# EAGLE design nrf24 (EAGLE 6.5.0)
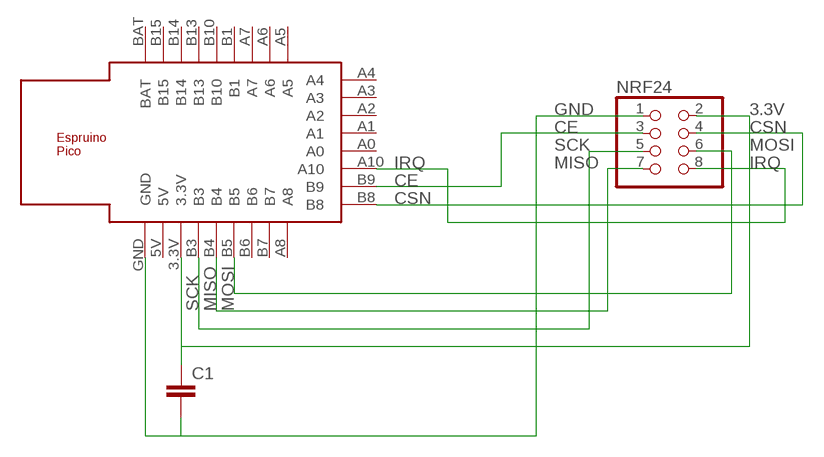
[diagram p0: schematic, sheet 1]

## Parts
C1  C-EUC1206  [C1206]
NRF24  PINHD-2X4  [2X04]
U$2  ESPRUINO_PICO_HALFSMD  [ESPRUINO_PICO_HALFSMD]

## Nets
3.3V: C1.1 NRF24.2 U$2.3.3V
CE: NRF24.3 U$2.B9
CSN: NRF24.4 U$2.B8
GND: C1.2 NRF24.1 U$2.GND
IRQ: NRF24.8 U$2.A10
MISO: NRF24.7 U$2.B4
MOSI: NRF24.6 U$2.B5
SCK: NRF24.5 U$2.B3
Unconnected: U$2.5V U$2.A0 U$2.A1 U$2.A2 U$2.A3 U$2.A4 U$2.A5 U$2.A6 U$2.A7 U$2.A8 U$2.B1 U$2.B6 U$2.B7 U$2.B10 U$2.B13 U$2.B14 U$2.B15 U$2.BAT

## Library data of the parts
C1 = rcl:C-EU: CAPACITOR, European symbol
NRF24 = pinhead:PINHD-2X4: PIN HEADER
U$2 = espruino_pico:ESPRUINO_PICO_HALFSMD

## Net classes
0 default: width 0.305 mm

## Board
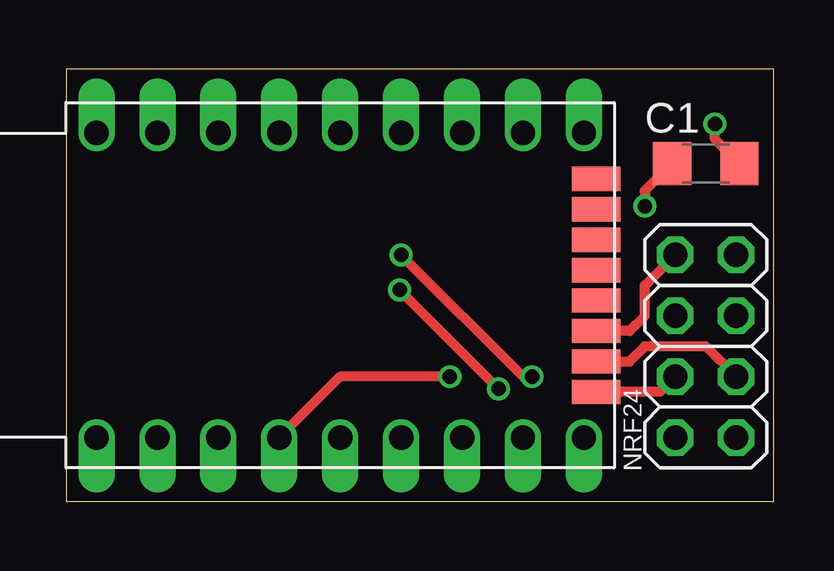
[diagram p1: board, top side]
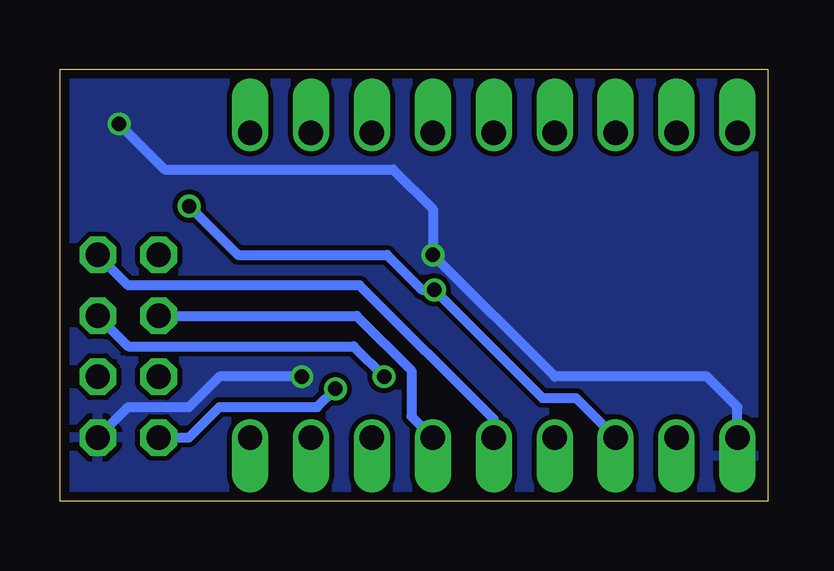
[diagram p2: board, bottom side, seen from below]

Size 29.52 x 18.02 mm. Coordinates in mm from the lower left corner, seen from the top.
Outline: 0,0 29.52,0 29.52,18.02 0,18.02 0,0
Copper layers (1*16): Top 0.0356mm / dielectric 1.5011mm / Bottom 0.0356mm
Design rules "oshpark": minimum track width 10mil, minimum drill 13mil, track to track 8mil, track to pad 6mil, pad to pad 6mil, via to via 6mil, smd to smd 6mil, copper to edge 15mil, drill to drill 6mil, minimum pad ring 7mil, minimum via ring 7mil, stop-mask expansion 4mil, vias tented up to drill 15mil, thermal gap 10mil

### Footprints (pad centres in the part's own frame; a part is rotated, then mirrored left to right if it is on the bottom)
C1206 = smd 1.6 x 1.8: 1 -1.4,0; 2 1.4,0
2X04 = drill 1.016 octagon: 1 -3.81,-1.27; 2 -3.81,1.27; 3 -1.27,-1.27; 4 -1.27,1.27; 5 1.27,-1.27; 6 1.27,1.27; 7 3.81,-1.27; 8 3.81,1.27
ESPRUINO_PICO_HALFSMD = drill 1.016 offset: 3.3V -7.62,-6.35; 5V -10.16,-6.35; A5 7.62,6.35; A6 5.08,6.35; A7 2.54,6.35; A8 7.62,-6.35; B1 0,6.35; B3 -5.08,-6.35; B4 -2.54,-6.35; B5 0,-6.35; B6 2.54,-6.35; B7 5.08,-6.35; B10 -2.54,6.35; B13 -5.08,6.35; B14 -7.62,6.35; B15 -10.16,6.35; BAT -12.7,6.35; GND -12.7,-6.35 | smd 2.032 x 1.016: A0 8.128,-0.635; A1 8.128,0.635; A2 8.128,1.905; A3 8.128,3.175; A4 8.128,4.445; A10 8.128,-1.905; B8 8.128,-4.445; B9 8.128,-3.175

### Placement (x,y rotation side)
C1  26.67,14.1 0 top
NRF24  26.67,6.48 90 top
U$2  13.97,9.02 0 top

### Tracks (layer width: path | path; a pad name or v marks a point on that pad's centre or on a via)
3.3V  (via drill 0.6)
  Top 0.406: 24.77,13.46 25.27,13.97 C1.1 24.13,12.96 v24.13,12.32 | v13.91,8.83 v18.03,4.7
  Bottom 0.406: U$2.3.3V 8,4.32 9.4,4.32 v13.91,8.83 14.41,8.83 15.88,10.29 22.1,10.29 v24.13,12.32 | NRF24.2 24.13,2.67 22.86,3.94 18.8,3.94 v18.03,4.7
CE
  Top 0.406: NRF24.3 26.67,6.48 24.13,6.48 23.5,5.84 U$2.B9
CSN
  Top 0.406: NRF24.4 24.77,4.57 U$2.B8
GND  (via drill 0.6)
  Top 0.406: v13.97,10.29 19.05,5.21 v19.43,5.21 | C1.2 27.05,15.12 v27.05,15.75
  Bottom 0.406: U$2.GND 1.27,3.94 2.54,5.21 8.89,5.21 v13.97,10.29 13.97,12.19 15.62,13.84 25.15,13.84 v27.05,15.75 | NRF24.1 26.67,3.94 24.13,3.94 22.86,5.21 v19.43,5.21 19.18,5.21
  pour Bottom: 0,17.91 29.46,17.91 29.46,0 0,0
IRQ
  Top 0.406: NRF24.8 24.13,9.02 24.13,7.75 23.5,7.11 U$2.A10
MISO
  Bottom 0.406: U$2.B4 11.43,3.43 17.02,9.02 26.67,9.02 NRF24.7
MOSI
  Bottom 0.406: NRF24.6 17.14,7.75 14.86,5.46 14.86,3.56 U$2.B5
SCK  (via drill 0.6)
  Top 0.406: v16,5.21 11.43,5.21 U$2.B3
  Bottom 0.406: NRF24.5 26.67,6.48 17.27,6.48 v16,5.21